# EAGLE design exoShield (EAGLE 8.1.0)
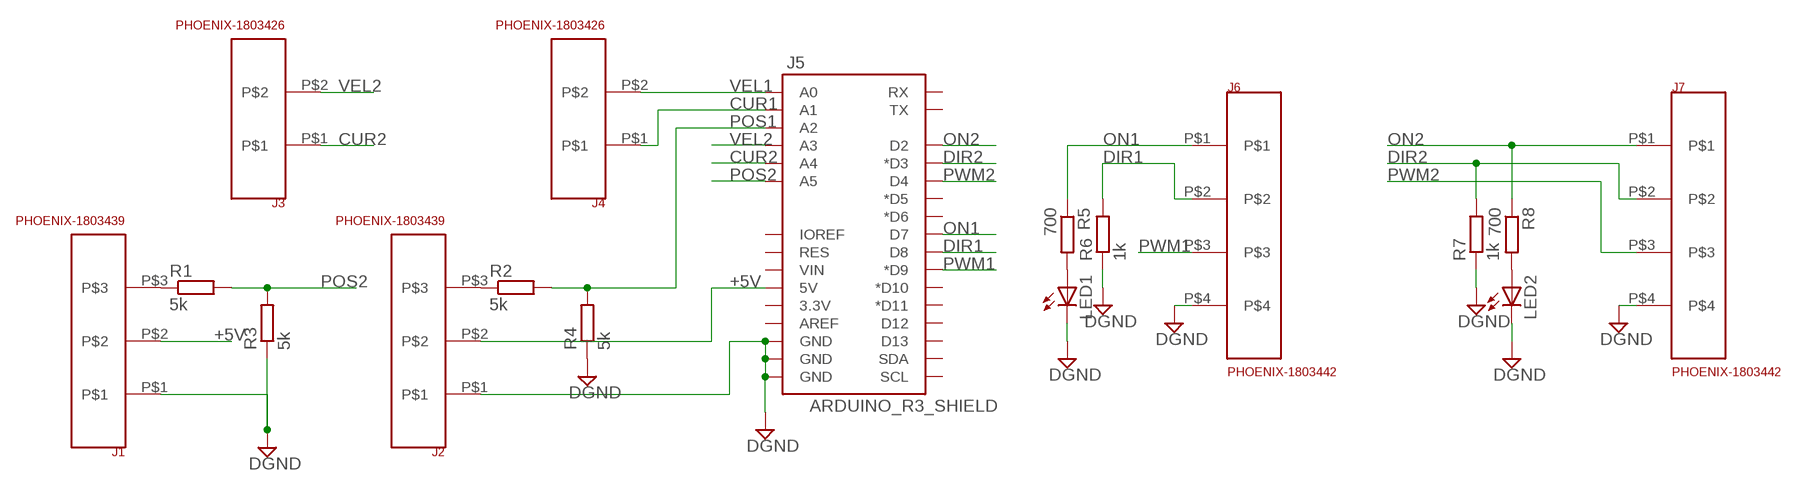
[diagram p0: schematic, sheet 1]

## Parts
J1  PHOENIX-1803439  [PHOENIX-1803439]
J2  PHOENIX-1803439  [PHOENIX-1803439]
J3  PHOENIX-1803426  [PHOENIX-1803426]
J4  PHOENIX-1803426  [PHOENIX-1803426]
J5  ARDUINO_R3_SHIELD  [UNO_R3_SHIELD]
J6  PHOENIX-1803442  [PHOENIX-1803442]
J7  PHOENIX-1803442  [PHOENIX-1803442]
LED1  LED3MM  [LED3MM]
LED2  LED3MM  [LED3MM]
R1  5k  R-EU_0207/10  [0207/10]
R2  5k  R-EU_0207/10  [0207/10]
R3  5k  R-EU_0207/10  [0207/10]
R4  5k  R-EU_0207/10  [0207/10]
R5  700  R-EU_0207/10  [0207/10]
R6  1k  R-EU_0207/10  [0207/10]
R7  1k  R-EU_0207/10  [0207/10]
R8  700  R-EU_0207/10  [0207/10]

## Nets
+5V: J1.P$2 J2.P$2 J5.5V
CUR1: J4.P$1 J5.A1
CUR2: J3.P$1 J5.A4
DGND: J1.P$1 J2.P$1 J5.GND@0(GND) J5.GND@1(GND) J5.GND@2(GND) J6.P$4 J7.P$4 LED1.K(C) LED2.K(C) R3.1 R4.1 R6.1 R7.1
DIR1: J5.D8 J6.P$2 R6.2
DIR2: J5.D3(*D3) J7.P$2 R7.2
N$1: LED2.A R8.2
N$3: J2.P$3 R2.1
N$6: J1.P$3 R1.1
N$8: LED1.A R5.2
ON1: J5.D7 J6.P$1 R5.1
ON2: J5.D2 J7.P$1 R8.1
POS1: J5.A2 R2.2 R4.2
POS2: J5.A5 R1.2 R3.2
PWM1: J5.D9(*D9) J6.P$3
PWM2: J5.D4 J7.P$3
VEL1: J4.P$2 J5.A0
VEL2: J3.P$2 J5.A3
Unconnected: J5.3.3V J5.AREF J5.D5(*D5) J5.D6(*D6) J5.D10(*D10) J5.D11(*D11) J5.D12 J5.D13 J5.IOREF J5.RES J5.RX J5.SCL J5.SDA J5.TX J5.VIN

## Library data of the parts
J1 J2 = exoShield:PHOENIX-1803439
J3 J4 = exoShield:PHOENIX-1803426
J5 = exoShield:ARDUINO_R3_SHIELD: Shield form compatible with the Arduino Uno R3.
J6 J7 = exoShield:PHOENIX-1803442
LED1 LED2 = exoShield:LED: LED OSRAM: - CHIPLED LG R971, LG N971, LY N971, LG Q971, LY Q971, LO R971, LY R971 LH N974, LH R974 LS Q976, LO Q976, LY Q976 LO Q996 - Hyper CHIPLED LW Q18S LB Q993, LB Q99A, LB R99A - SideLED LS A670, LO A670, LY A670, LG A670, LP A670 LB A673, LV A673, LT A673, LW A673 LH A674 LY A675 LS A676, LA A676, LO A676, LY A676, LW A676 LS A679, LY A679, LG A679 - Hyper Micro SIDELED® LS Y876, LA Y876, LO Y876, LY Y876 LT Y87S - SmartLED LW L88C, LW L88S LB L89C, LB L89S, LG L890 LS L89K, LO L89K, LY L89K LS L896, LA L896, LO L896, LY L896 - TOPLED LS T670, LO T670, LY T670, LG T670, LP T670 LSG T670, LSP T670, LSY T670, LOP T670, LYG T670 LG T671, LOG T671, LSG T671 LB T673, LV T673, LT T673, LW T673 LH T674 LS T676, LA T676, LO T676, LY T676, LB T676, LH T676, LSB T676, LW T676 LB T67C, LV T67C, LT T67C, LS T67K, LO T67K, LY T67K, LW E67C LS E67B, LA E67B, LO E67B, LY E67B, LB E67C, LV E67C, LT E67C LW T67C LS T679, LY T679, LG T679 LS T770, LO T770, LY T770, LG T770, LP T770 LB T773, LV T773, LT T773, LW T773 LH T774 LS E675, LA E675, LY E675, LS T675 LS T776, LA T776, LO T776, LY T776, LB T776 LHGB T686 LT T68C, LB T68C - Hyper Mini TOPLED® LB M676 - Mini TOPLED Santana® LG M470 LS M47K, LO M47K, LY M47K Source: http://www.osram.convergy.de LUXEON: - LUMILED® LXK2-PW12-R00, LXK2-PW12-S00, LXK2-PW14-U00, LXK2-PW14-V00 LXK2-PM12-R00, LXK2-PM12-S00, LXK2-PM14-U00 LXK2-PE12-Q00, LXK2-PE12-R00, LXK2-PE12-S00, LXK2-PE14-T00, LXK2-PE14-U00 LXK2-PB12-K00, LXK2-PB12-L00, LXK2-PB12-M00, LXK2-PB14-N00, LXK2-PB14-P00, LXK2-PB14-Q00 LXK2-PR12-L00, LXK2-PR12-M00, LXK2-PR14-Q00, LXK2-PR14-R00 LXK2-PD12-Q00, LXK2-PD12-R00, LXK2-PD12-S00 LXK2-PH12-R00, LXK2-PH12-S00 LXK2-PL12-P00, LXK2-PL12-Q00, LXK2-PL12-R00 Source: www.luxeon.com KINGBRIGHT: KA-3528ASYC Source: www.kingbright.com
R1-R8 = exoShield:R-EU_: RESISTOR, European symbol

## Board
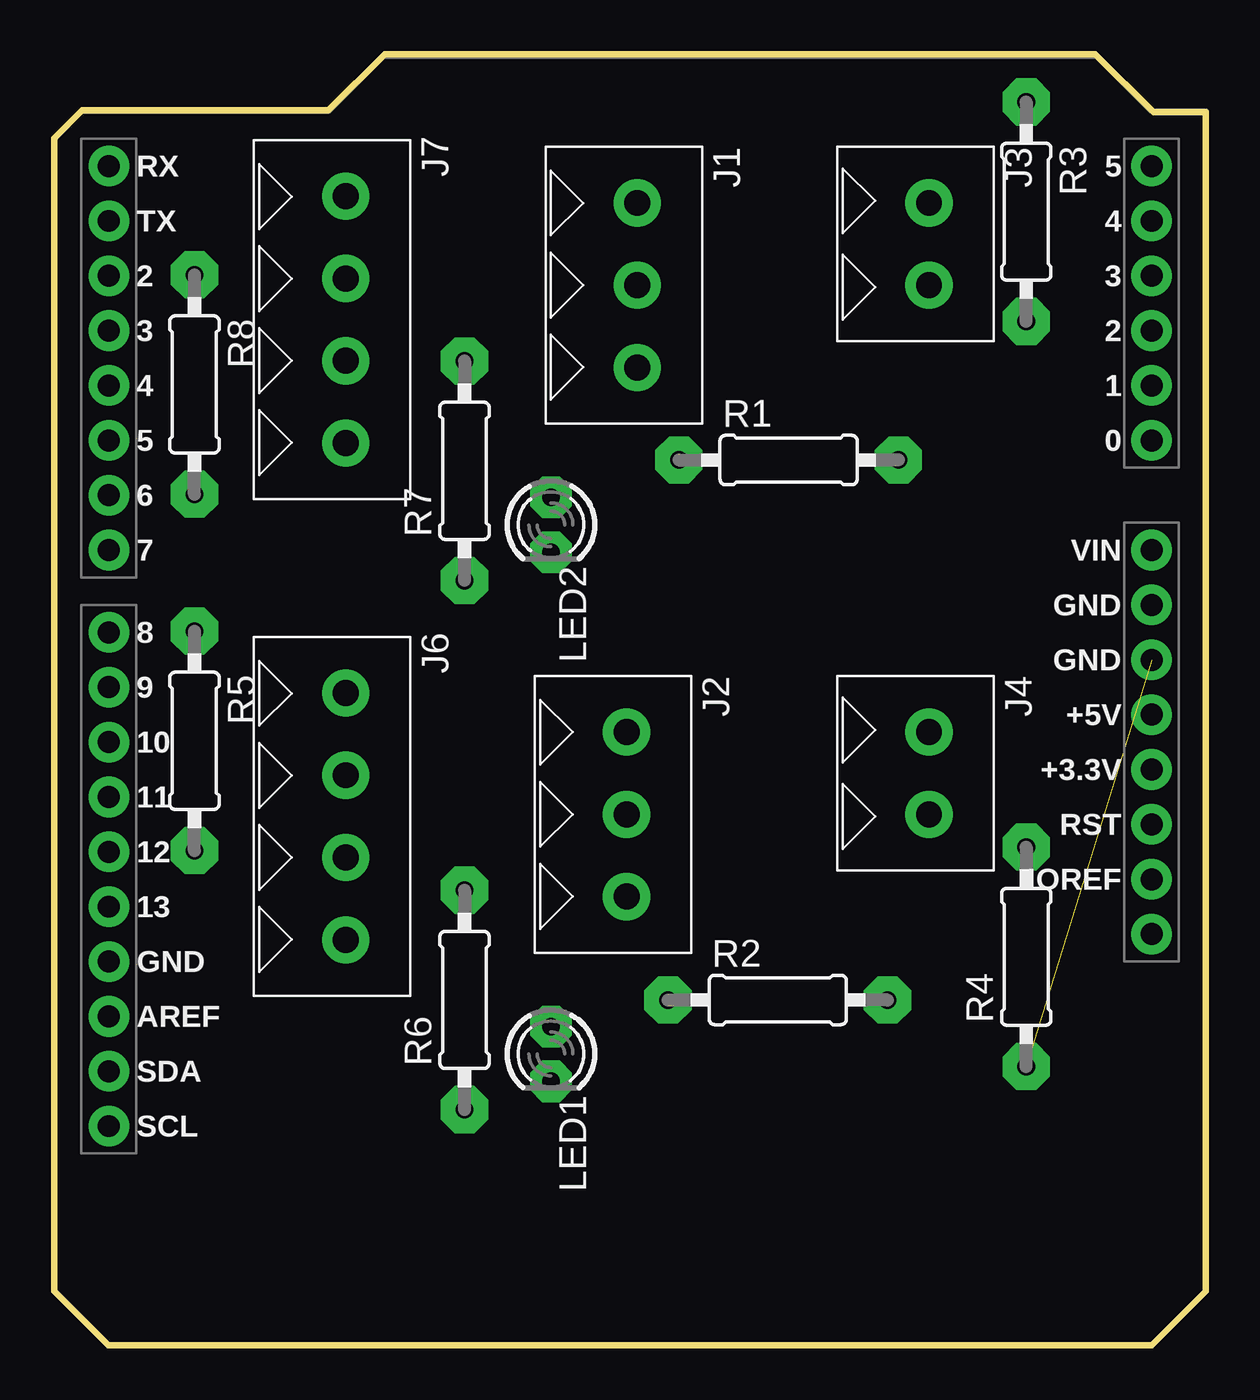
[diagram p1: board, top side]
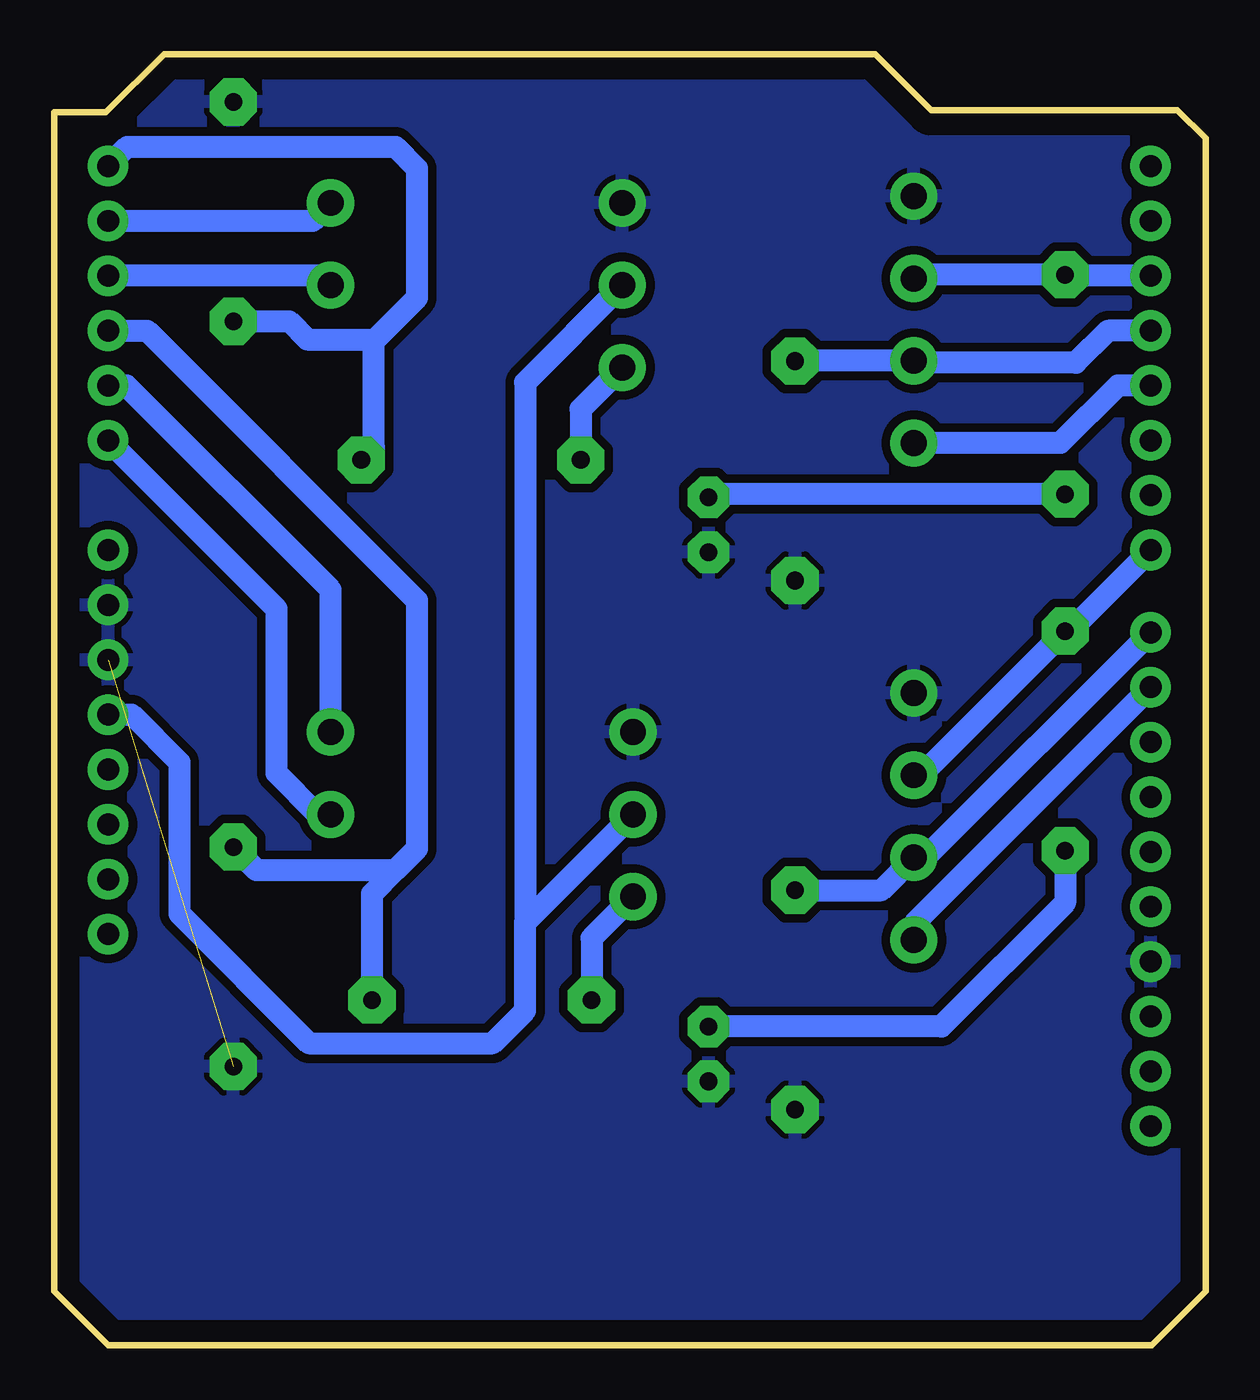
[diagram p2: board, bottom side, seen from below]

Size 53.3 x 59.8 mm. Coordinates in mm from the lower left corner, seen from the top.
Outline: 0,2.5 2.5,0 50.8,0 53.3,2.5 53.3,57.1 50.9,57.1 48.2,59.8 15.3,59.8 12.7,57.2 1.3,57.2 0,55.9 0,2.5
Copper layers (1*16): Top 0.035mm / dielectric 1.5mm / Bottom 0.035mm
Design rules "default": minimum track width 10mil, minimum drill 24mil, track to track 8mil, track to pad 8mil, pad to pad 8mil, via to via 8mil, smd to smd 8mil, copper to edge 40mil, drill to drill 8mil, minimum pad ring 10mil, minimum via ring 8mil, stop-mask expansion 4mil, vias tented up to drill 0mil, thermal gap 10mil

### Footprints (pad centres in the part's own frame; a part is rotated, then mirrored left to right if it is on the bottom)
PHOENIX-1803439 = drill 1.2 pad 2.184: P$1 -1.905,0; P$2 1.905,0; P$3 5.715,0
PHOENIX-1803426 = drill 1.2 pad 2.184: P$1 -1.905,0; P$2 1.905,0
UNO_R3_SHIELD = drill 1.016 pad 1.88: 3.3V 50.8,26.67; 5V 50.8,29.21; A0 50.8,41.91; A1 50.8,44.45; A2 50.8,46.99; A3 50.8,49.53; A4 50.8,52.07; A5 50.8,54.61; AREF 2.54,15.24; D2 2.54,49.53; D3 2.54,46.99; D4 2.54,44.45; D5 2.54,41.91; D6 2.54,39.37; D7 2.54,36.83; D8 2.54,33.02; D9 2.54,30.48; D10 2.54,27.94; D11 2.54,25.4; D12 2.54,22.86; D13 2.54,20.32; GND@0 50.8,31.75; GND@1 50.8,34.29; GND@2 2.54,17.78; IOREF 50.8,21.59; NC 50.8,19.05; RES 50.8,24.13; RX 2.54,54.61; SCL 2.54,10.16; SDA 2.54,12.7; TX 2.54,52.07; VIN 50.8,36.83
PHOENIX-1803442 = drill 1.2 pad 2.184: P$1 -1.905,0; P$2 1.905,0; P$3 5.715,0; P$4 -5.715,0
LED3MM = drill 0.813 pad 1.93 octagon: A -1.27,0; K 1.27,0
0207/10 = drill 0.813 pad 2.184 octagon: 1 -5.08,0; 2 5.08,0

### Placement (x,y rotation side)
J1  27,51 270 top
J2  26.5,26.5 270 top
J3  40.5,51 270 top
J4  40.5,26.5 270 top
J5  0,0 0 top
J6  13.5,24.5 270 top
J7  13.5,47.5 270 top
LED1  23,13.5 270 top
LED2  23,38 270 top
R1  34,41 0 top
R2  33.5,16 0 top
R3  45,52.5 270 top
R4  45,18 90 top
R5  6.5,28 270 top
R6  19,16 90 top
R7  19,40.5 90 top
R8  6.5,44.5 270 top

### Tracks (layer width: path | path; a pad name or v marks a point on that pad's centre or on a via)
+5V
  Bottom 1.016: J5.5V 49.71,29.21 47.5,27 47.5,20 41.5,14 33,14 31.5,15.5 31.5,19.59 | 31.5,19.59 J2.P$2 | J1.P$2 31.5,44.59 31.5,19.59
CUR1
  Bottom 1.016: J4.P$1 40.5,35 49.95,44.45 J5.A1
CUR2
  Bottom 1.016: J3.P$1 41.34,52.07 J5.A4
DGND  (1 unrouted)
  pour Bottom (isolate 0.406): -0.5,61.5 54,61.5 54,0 -0.5,0
DIR1
  Bottom 1.016: J5.D8 12.96,22.59 J6.P$2 15.02,21.08 R6.2
DIR2
  Bottom 1.016: J5.D3 4.51,46.99 6,45.5 13.4,45.5 J7.P$2 18.98,45.59 R7.2
GND
  pour Bottom: 31.5,5 31.5,1.5 50.5,1.5 50.5,5
N$1
  Bottom 1.016: R8.2 22.85,39.42 LED2.A
N$3
  Bottom 1.016: J2.P$3 28.42,18.86 R2.1
N$6
  Bottom 1.016: J1.P$3 28.92,43.37 R1.1
N$8
  Bottom 1.016: R5.2 6.5,20.5 12.23,14.77 LED1.A
ON1
  Bottom 1.016: J5.D7 6.29,33.08 R5.1 13.18,26.41 J6.P$1
ON2
  Bottom 1.016: J5.D2 6.45,49.53 R8.1 13.32,49.58 J7.P$1
POS1
  Bottom 1.016: 37.5,22 36.5,23 36.5,34.5 48.99,46.99 J5.A2 | 37.5,22 43.92,22 R4.2 | R2.2 38.58,20.92 37.5,22
POS2
  Bottom 1.016: J5.A5 49.91,55.5 37.5,55.5 36.5,54.5 36.5,48.5 38.42,46.58 38.5,46.58 | R1.2 38.5,41.58 38.5,46.58 | R3.2 42.42,47.42 41.58,46.58 38.5,46.58
PWM1
  Bottom 1.016: J5.D9 13.5,19.52 J6.P$3
PWM2
  Bottom 1.016: J5.D4 4.05,44.45 6.71,41.78 J7.P$3
VEL1
  Bottom 1.016: J4.P$2 41.09,24.59 43,26.5 43,34.11 J5.A0
VEL2
  Bottom 1.016: J3.P$2 40.94,49.53 J5.A3

### Text on the board
bRestrict: UDOO I/O 1.1